# EAGLE design NodeMCU (EAGLE 9.6.2)
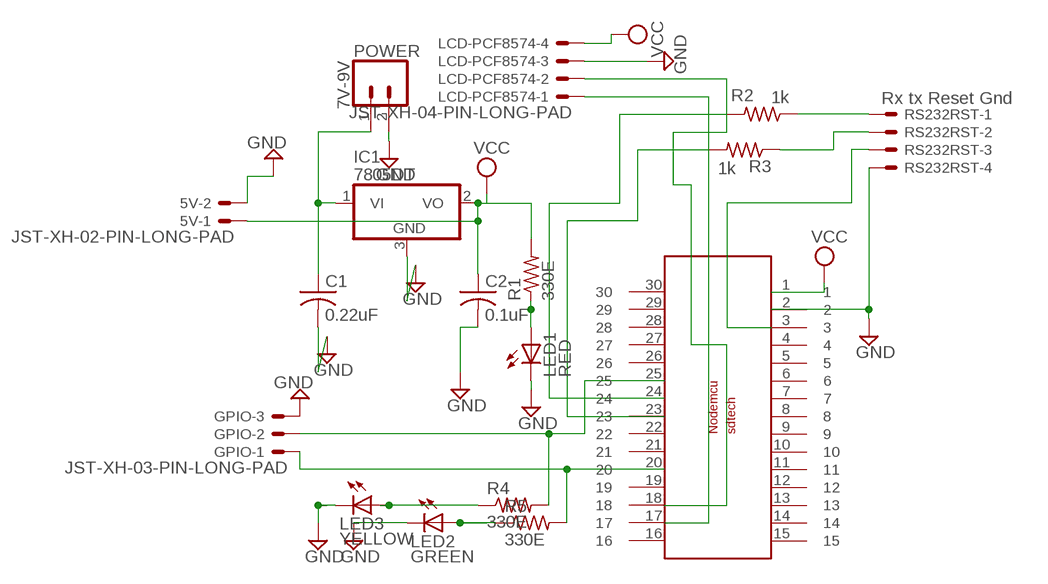
[diagram p0: schematic, sheet 1]

## Parts
5V  JST-XH-02-PIN-LONG-PAD  [JST-XH-02-PACKAGE-LONG-PAD]
C1  0.22uF  C-USC0805K  [C0805K]
C2  0.1uF  C-USC0805K  [C0805K]
GPIO  JST-XH-03-PIN-LONG-PAD  [JST-XH-03-PACKAGE-LONG-PAD]
IC1  7805DT  [TO252]
LCD-PCF8574  JST-XH-04-PIN-LONG-PAD  [JST-XH-04-PACKAGE-LONG-PAD]
LED1  RED  LEDCHIPLED_0805  [CHIPLED_0805]
LED2  GREEN  LEDCHIPLED_0805  [CHIPLED_0805]
LED3  YELLOW  LEDCHIPLED_0805  [CHIPLED_0805]
POWER  7V-9V  CONN_025MM  [SCREWTERMINAL-5MM-2]
R1  330E  R-US_M0805  [M0805]
R2  1k  R-US_M0805  [M0805]
R3  1k  R-US_M0805  [M0805]
R4  330E  R-US_M0805  [M0805]
R5  330E  R-US_M0805  [M0805]
RS232RST  Rx tx Reset Gnd  JST-XH-04-PIN-LONG-PAD  [JST-XH-04-PACKAGE-LONG-PAD]
U$2  NodeMCU-ESP12E  NODEMCUESP8266  [NODEMCUESP8266]

## Nets
GND: 5V.2 C1.2 C2.2 GPIO.3 IC1.3(GND) LCD-PCF8574.3 LED1.C LED2.C LED3.C POWER.2 RS232RST.4 U$2.2
N$1: LED1.A R1.1
N$2: LCD-PCF8574.2 U$2.18
N$3: LED3.A R4.1
N$4: LED2.A R5.1
N$5: R2.1 RS232RST.1
N$6: R2.2 U$2.24
N$7: LCD-PCF8574.1 U$2.17
N$8: R3.2 U$2.23
N$9: C1.1 IC1.1(VI) POWER.1
N$10: R3.1 RS232RST.2
N$11: RS232RST.3 U$2.3
N$12: GPIO.2 R4.2 U$2.25
N$13: GPIO.1 R5.2 U$2.20
VCC: 5V.1 C2.1 IC1.2(VO) LCD-PCF8574.4 R1.2 U$2.1
Unconnected: U$2.4 U$2.5 U$2.6 U$2.7 U$2.8 U$2.9 U$2.10 U$2.11 U$2.12 U$2.13 U$2.14 U$2.15 U$2.16 U$2.19 U$2.21 U$2.22 U$2.26 U$2.27 U$2.28 U$2.29 U$2.30

## Library data of the parts
5V = Rembrandt Electronics - JST XH Connectors v1-0:JST-XH-02-PIN: JST XH Connector 2 Pin Wire to board connector. Pitch: 2,54 mm, (0.100") Number of pins: 2 Created by Rembrandt Electronics www.rembrandtelectronics.com
C1 C2 = adafruit:C-US: CAPACITOR, American symbol
GPIO = Rembrandt Electronics - JST XH Connectors v1-0:JST-XH-03-PIN: JST XH Connector 2 Pin Wire to board connector. Pitch: 2,54 mm, (0.100") Number of pins: 3 Created by Rembrandt Electronics www.rembrandtelectronics.com
IC1 = adafruit:78*: Positive VOLTAGE REGULATOR Added bigger pads to the TO-92 package
LCD-PCF8574 RS232RST = Rembrandt Electronics - JST XH Connectors v1-0:JST-XH-04-PIN: JST XH Connector 2 Pin Wire to board connector. Pitch: 2,54 mm, (0.100") Number of pins: 4 Created by Rembrandt Electronics www.rembrandtelectronics.com
LED1-LED3 = adafruit:LED: LED OSRAM: - CHIPLED LG R971, LG N971, LY N971, LG Q971, LY Q971, LO R971, LY R971 LH N974, LH R974 LS Q976, LO Q976, LY Q976 LO Q996 - Hyper CHIPLED LW Q18S LB Q993, LB Q99A, LB R99A - SideLED LS A670, LO A670, LY A670, LG A670, LP A670 LB A673, LV A673, LT A673, LW A673 LH A674 LY A675 LS A676, LA A676, LO A676, LY A676, LW A676 LS A679, LY A679, LG A679 - Hyper Micro SIDELED® LS Y876, LA Y876, LO Y876, LY Y876 LT Y87S - SmartLED LW L88C, LW L88S LB L89C, LB L89S, LG L890 LS L89K, LO L89K, LY L89K LS L896, LA L896, LO L896, LY L896 - TOPLED LS T670, LO T670, LY T670, LG T670, LP T670 LSG T670, LSP T670, LSY T670, LOP T670, LYG T670 LG T671, LOG T671, LSG T671 LB T673, LV T673, LT T673, LW T673 LH T674 LS T676, LA T676, LO T676, LY T676, LB T676, LH T676, LSB T676, LW T676 LB T67C, LV T67C, LT T67C, LS T67K, LO T67K, LY T67K, LW E67C LS E67B, LA E67B, LO E67B, LY E67B, LB E67C, LV E67C, LT E67C LW T67C LS T679, LY T679, LG T679 LS T770, LO T770, LY T770, LG T770, LP T770 LB T773, LV T773, LT T773, LW T773 LH T774 LS E675, LA E675, LY E675, LS T675 LS T776, LA T776, LO T776, LY T776, LB T776 LHGB T686 LT T68C, LB T68C - Hyper Mini TOPLED® LB M676 - Mini TOPLED Santana® LG M470 LS M47K, LO M47K, LY M47K Source: http://www.osram.convergy.de/
POWER = SparkFun-Connectors:CONN_02: Multi connection point. Often used as Generic Header-pin footprint for 0.1 inch spaced/style header connections On any of the 0.1 inch spaced packages, you can populate with these: Break Away Headers - Straight <https://www.sparkfun.com/products/116> (PRT-00116) Break Away Male Headers - Right Angle <https://www.sparkfun.com/products/553> (PRT-00553) Female Headers <https://www.sparkfun.com/products/115> (PRT-00115) Break Away Headers - Machine Pin <https://www.sparkfun.com/products/117> (PRT-00117) Break Away Female Headers - Swiss Machine Pin <https://www.sparkfun.com/products/743> (PRT-00743) For SCREWTERMINALS and SPRING TERMINALS visit here: Screw Terimnals on SparkFun.com <https://www.sparkfun.com/search/results?term=Screw+Terminals> (5mm/3.5mm/2.54mm spacing) This device is also useful as a general connection point to wire up your design to another part of your project. Our various solder wires solder well into these plated through hole pads. Hook-Up Wire - Assortment (Stranded, 22 AWG) <https://www.sparkfun.com/products/11375> (PRT-11375) Hook-Up Wire - Assortment (Solid Core, 22 AWG) <https://www.sparkfun.com/products/11367> (PRT-11367) View the entire wire category on our website here <https://www.sparkfun.com/categories/141> Special notes: Molex polarized connector foot print use with: PRT-08233 with associated crimp pins and housings. 2.54_SCREWTERM for use with PRT-10571. 3.5mm Screw Terminal footprints for PRT-08084 5mm Screw Terminal footprints for use with PRT-08432; SF_SKU: PRT-08432
R1-R5 = adafruit:R-US_: RESISTOR, American symbol
U$2 = NODEMCU:NODEMCUESP8266: Node Mcu esp8266 12E LIBRARY BY SDTECH ROBOTICS (Shubham Devkar Technology Solutions)

## Board
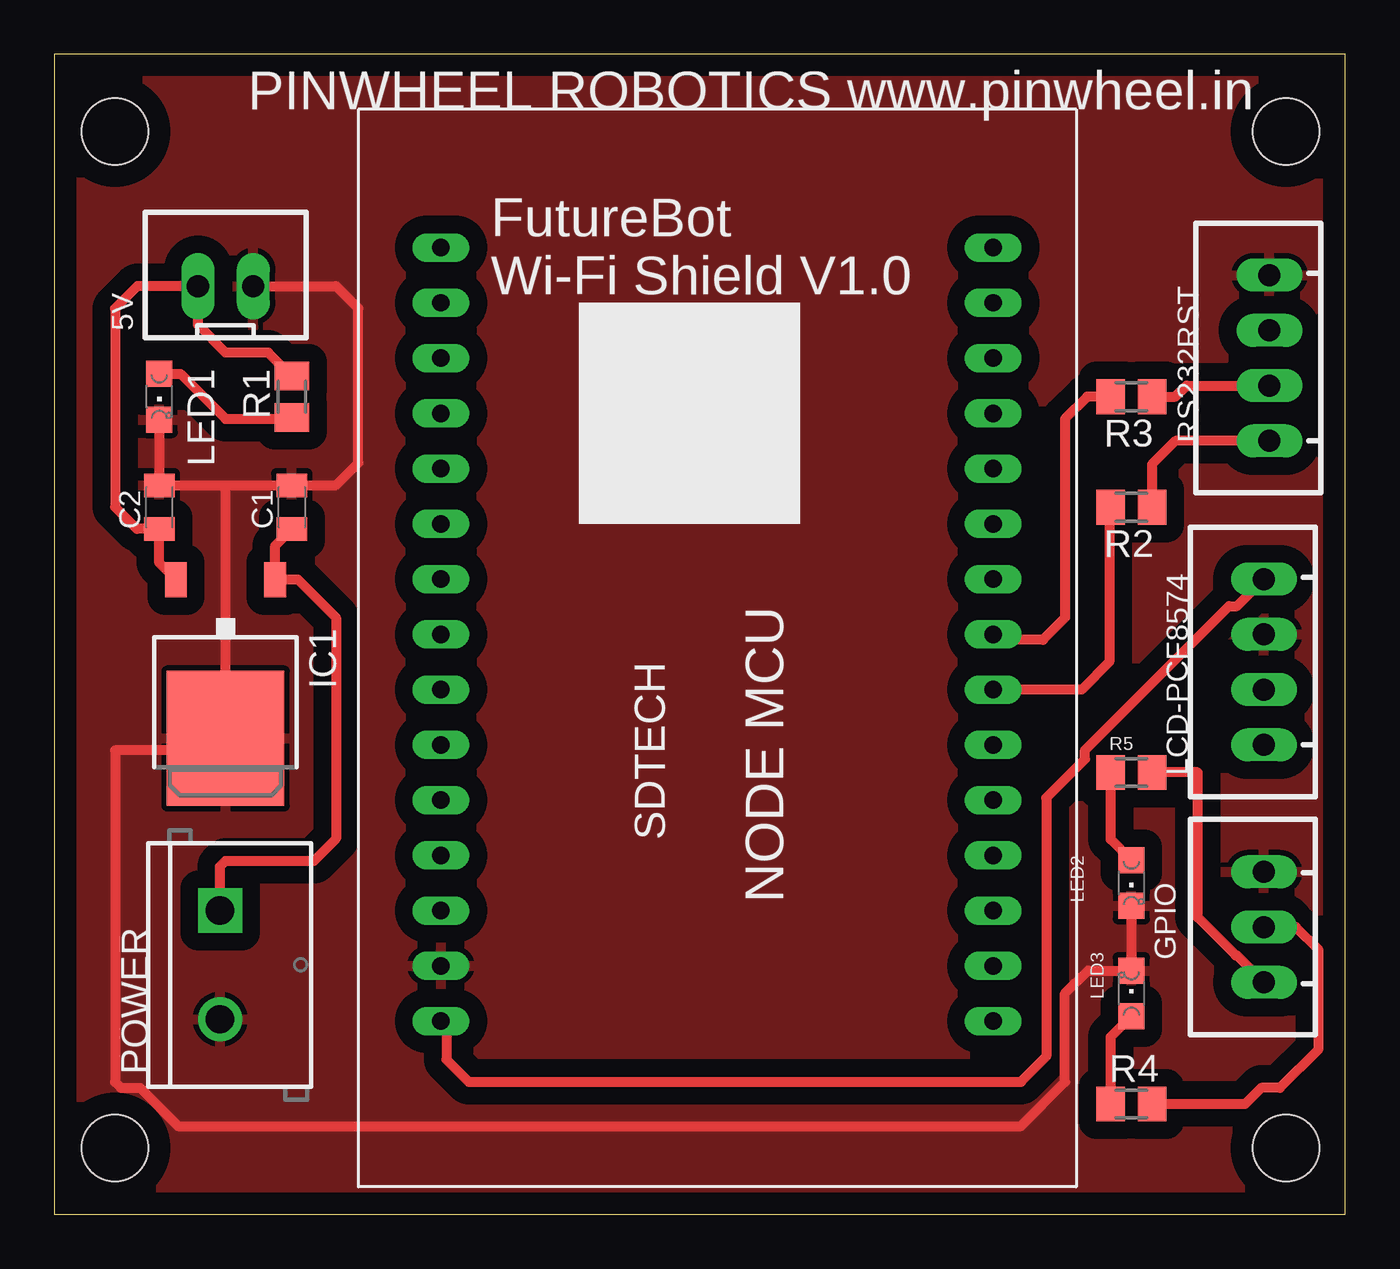
[diagram p1: board, top side]
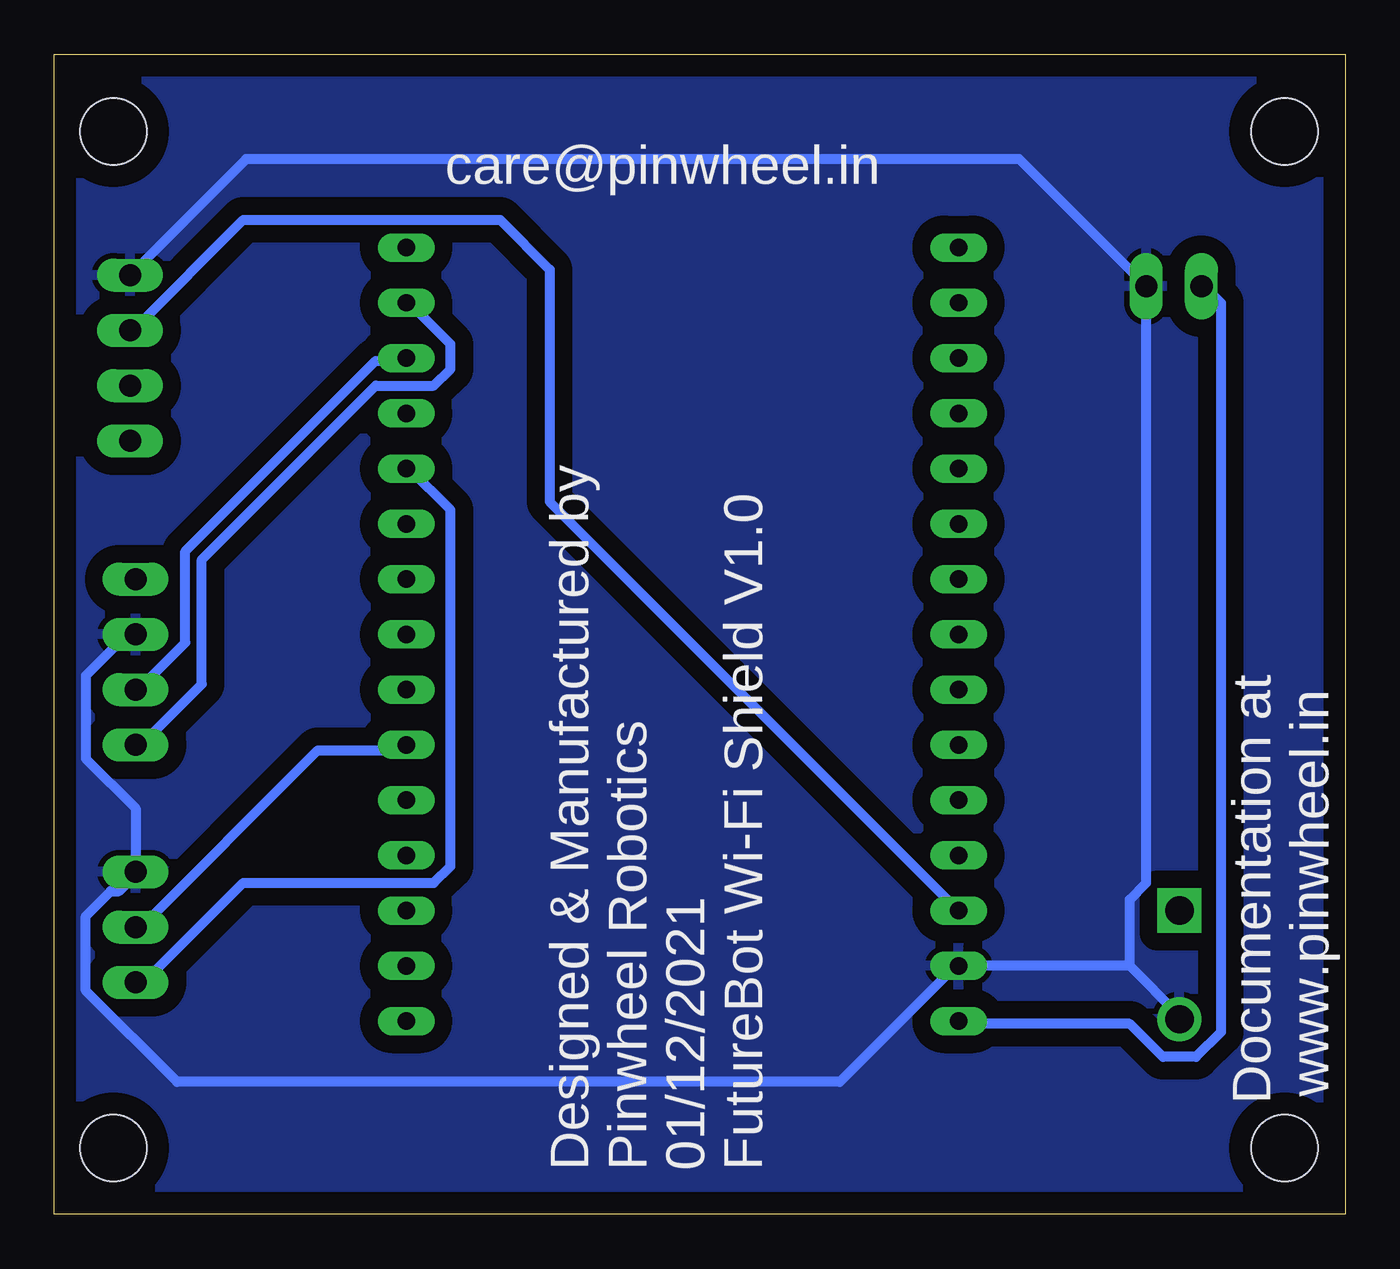
[diagram p2: board, bottom side, seen from below]

Size 59.36 x 53.33 mm. Coordinates in mm from the lower left corner, seen from the top.
Outline: 0,0 59.36,0 59.36,53.33 0,53.33 0,0
Copper layers (1*16): Top 0.035mm / dielectric 1.5mm / Bottom 0.035mm
Design rules "default *": minimum track width 18mil, minimum drill 0.35mm, track to track 12mil, track to pad 12mil, pad to pad 12mil, via to via 12mil, smd to smd 12mil, copper to edge 40mil, drill to drill 6mil, minimum pad ring 10mil, minimum via ring 20mil, stop-mask expansion 4mil, vias tented up to drill 0mil, thermal gap 10mil
Holes 3.05 mm at 2.79,49.78 56.64,49.78 56.64,3.05 2.79,3.05

### Footprints (pad centres in the part's own frame; a part is rotated, then mirrored left to right if it is on the bottom)
JST-XH-02-PACKAGE-LONG-PAD = drill 1.016 long: 1 -1.27,0; 2 1.27,0
C0805K = smd 1.1 x 1.4: 1 -1,0; 2 1,0
JST-XH-03-PACKAGE-LONG-PAD = drill 1.016 long: 1 -2.54,0; 2 0,0; 3 2.54,0
TO252 = smd 1 x 1.6: 1 -2.28,-4.8; 2 2.28,-4.8 | smd 5.4 x 6.2: 3 0,2.5
JST-XH-04-PACKAGE-LONG-PAD = drill 1.016 long: 1 -3.81,0; 2 -1.27,0; 3 1.27,0; 4 3.81,0
CHIPLED_0805 = smd 1.2 x 1.2: A 0,-1.05; C 0,1.05
SCREWTERMINAL-5MM-2 = drill 1.3 pad 2.032 square: 1 0,0 | drill 1.3 pad 2.032: 2 5,0
M0805 = smd 1.3 x 1.6: 1 -0.95,0; 2 0.95,0
NODEMCUESP8266 = drill 0.8 long: 1 15.24,15.24; 2 15.24,12.7; 3 15.24,10.16; 4 15.24,7.62; 5 15.24,5.08; 6 15.24,2.54; 7 15.24,0; 8 15.24,-2.54; 9 15.24,-5.08; 10 15.24,-7.62; 11 15.24,-10.16; 12 15.24,-12.7; 13 15.24,-15.24; 14 15.24,-17.78; 15 15.24,-20.32; 16 -10.16,-20.32; 17 -10.16,-17.78; 18 -10.16,-15.24; 19 -10.16,-12.7; 20 -10.16,-10.16; 21 -10.16,-7.62; 22 -10.16,-5.08; 23 -10.16,-2.54; 24 -10.16,0; 25 -10.16,2.54; 26 -10.16,5.08; 27 -10.16,7.62; 28 -10.16,10.16; 29 -10.16,12.7; 30 -10.16,15.24

### Placement (x,y rotation side)
5V  7.87,42.67 0 top
C1  10.92,32.51 90 top
C2  4.83,32.51 90 top
GPIO  55.63,13.21 90 top
IC1  7.87,24.38 180 top
LCD-PCF8574  55.63,25.4 90 top
LED1  4.83,37.59 180 top
LED2  49.53,15.24 180 top
LED3  49.53,10.16 0 top
POWER  7.62,13.97 270 top
R1  10.92,37.59 90 top
R2  49.53,32.51 180 top
R3  49.53,37.59 180 top
R4  49.53,5.08 0 top
R5  49.53,20.32 0 top
RS232RST  55.88,39.37 90 top
U$2  33.02,24.13 180 top

### Tracks (layer width: path | path; a pad name or v marks a point on that pad's centre or on a via)
GND
  Top 0.457: 7.87,33.51 C2.2 LED1.C | 7.87,33.51 C1.2 10.94,33.53 12.95,33.53 13.97,34.54 13.97,41.66 12.95,42.67 5V.2 | 7.87,33.51 IC1.3 7.33,21.34 2.79,21.34 2.79,6.1 3.07,5.82 3.94,5.82 5.69,4.06 44.45,4.06 46.48,6.1 46.48,10.16 47.53,11.21 LED3.C LED2.C
  Bottom 0.457: LCD-PCF8574.3 56.01,26.67 57.91,24.77 57.91,20.95 55.63,18.67 GPIO.3 55.63,15.62 56.39,14.86 56.77,14.86 57.91,13.72 57.91,10.29 53.72,6.1 23.24,6.1 17.91,11.43 U$2.2 9.91,11.43 | 9.91,11.43 7.62,9.14 POWER.2 | 9.91,11.43 9.91,14.48 9.14,15.24 5V.2 14.99,48.51 50.55,48.51 RS232RST.4
  pour Top (isolate 0.813): -0.25,53.85 59.69,53.85 59.69,0 -0.25,0
  pour Bottom (isolate 0.813): -0.25,53.85 59.69,53.85 59.69,0 -0.25,0
N$1
  Top 0.457: LED1.A 5.81,38.64 7.87,36.58 10.86,36.58 R1.1
N$2
  Bottom 0.457: U$2.18 43.43,39.24 44.58,39.24 53.34,30.48 53.34,26.29 55.63,24 LCD-PCF8574.2
N$3
  Top 0.457: R4.1 48.58,8.16 LED3.A
N$4
  Top 0.457: LED2.A 48.58,17.24 R5.1
N$5
  Top 0.457: RS232RST.1 51.56,35.56 50.48,34.48 R2.1
N$6
  Top 0.457: R2.2 48.51,32.45 48.51,25.4 47.24,24.13 U$2.24
N$7
  Bottom 0.457: U$2.17 43.05,41.91 41.15,40.01 41.15,38.86 41.91,38.1 44.58,38.1 52.58,30.1 52.58,24.38 55.63,21.34 LCD-PCF8574.1
N$8
  Top 0.457: R3.2 47.5,37.59 46.48,36.58 46.48,27.43 45.47,26.42 43.43,26.42 U$2.23
N$9
  Top 0.457: C1.1 10.15,30.74 IC1.1 11.2,29.18 12.95,27.43 12.95,17.27 11.94,16.26 7.87,16.26 7.62,16 POWER.1
N$10
  Top 0.457: R3.1 51.56,37.59 52.07,38.1 RS232RST.2
N$11
  Bottom 0.457: U$2.3 36.58,32.77 36.58,43.43 38.86,45.72 50.67,45.72 55.63,40.77 RS232RST.3
N$12
  Top 0.457: R4.2 54.76,5.08 55.5,5.82 56.36,5.82 58.11,7.57 58.11,12.19 57.1,13.21 GPIO.2
  Bottom 0.457: U$2.25 43.43,21.34 47.24,21.34 55.63,12.95 GPIO.2
N$13
  Top 0.457: GPIO.1 54.38,11.91 54.33,11.91 52.58,13.66 52.58,20.32 R5.2
  Bottom 0.457: GPIO.1 55.25,10.67 50.67,15.24 41.91,15.24 41.15,16 41.15,32.38 43.05,34.29 U$2.20
VCC
  Top 0.457: IC1.2 4.83,29.95 C2.1 3.79,31.51 2.79,32.51 2.79,41.66 3.81,42.67 5V.1 6.6,40.89 7.87,39.62 9.84,39.62 R1.2 | LCD-PCF8574.4 54.38,27.96 54.02,27.96 47.4,21.34 47.4,20.93 45.62,19.15 45.62,7.26 44.45,6.1 19.05,6.1 18.03,7.11 18.03,8.64 U$2.1
  Bottom 0.457: U$2.1 17.53,8.76 9.91,8.76 8.38,7.24 6.86,7.24 5.71,8.38 5.71,41.91 6.48,42.67 5V.1

### Text on the board
tNames: PINWHEEL ROBOTICS www.pinwheel.in | FutureBot / Wi-Fi Shield V1.0
bNames: care@pinwheel.in | www.pinwheel.in | Documentation at | Designed & Manufactured by / Pinwheel Robotics / 01/12/2021 / FutureBot Wi-Fi Shield V1.0